# EasyEDA Pro project ProPrj_mykeyboard_2026-01-04.epro, board mykeyboard
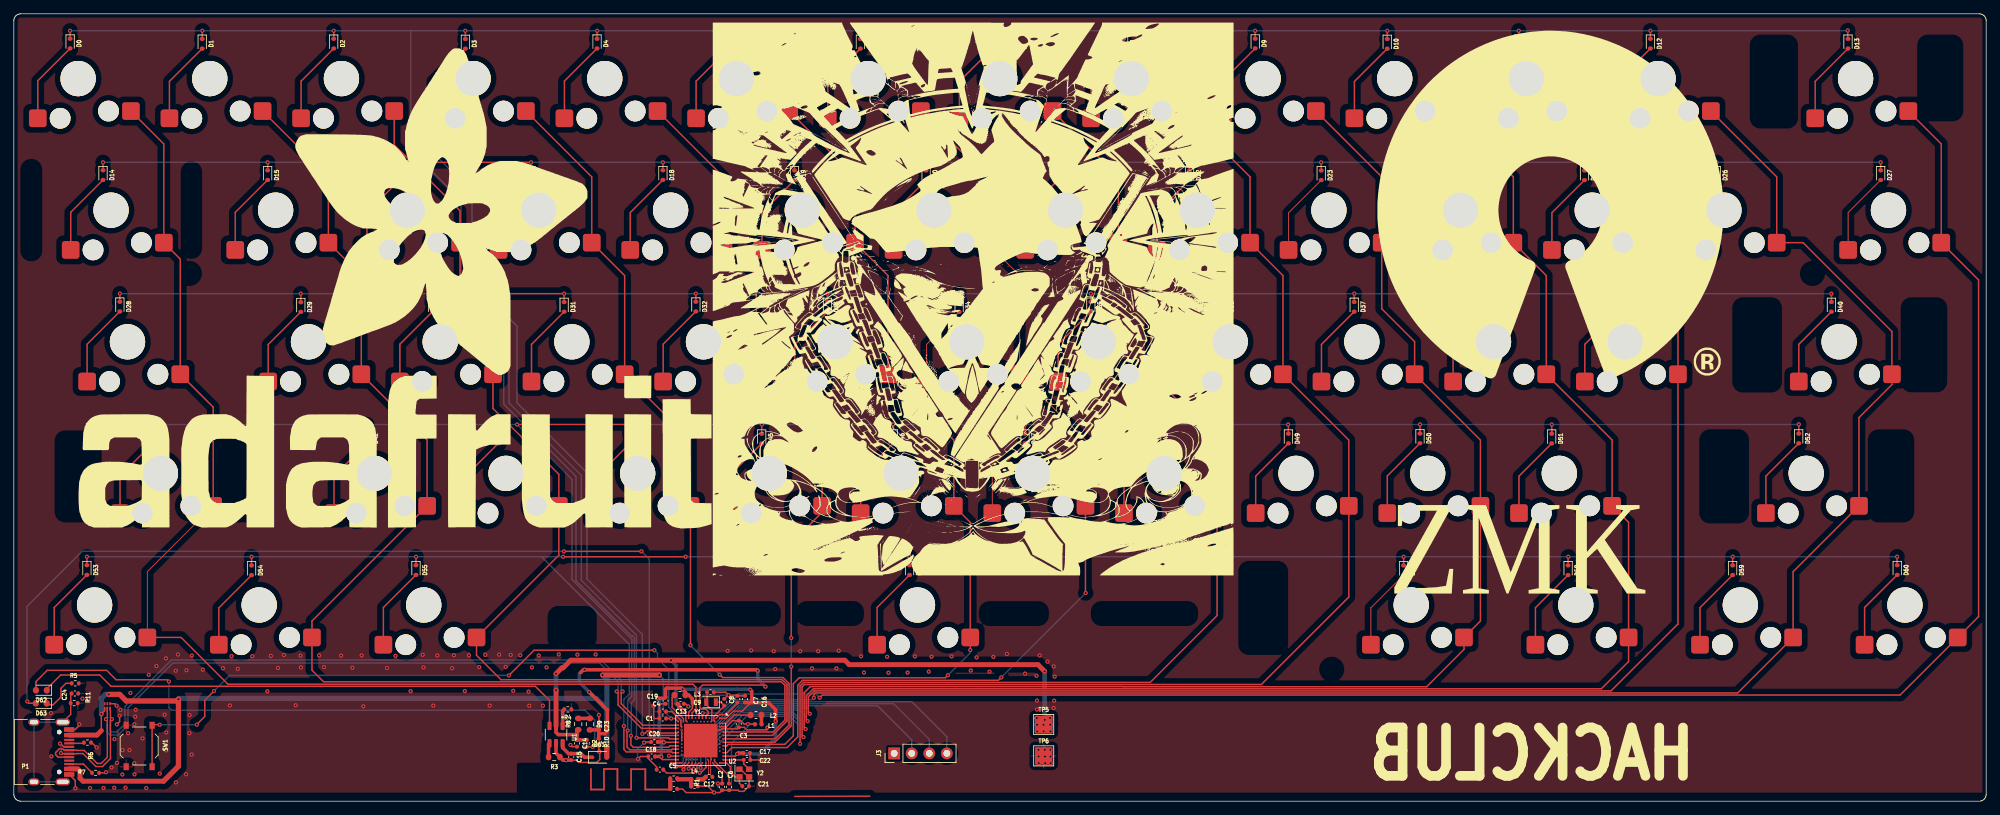
[diagram p1: board, top side]
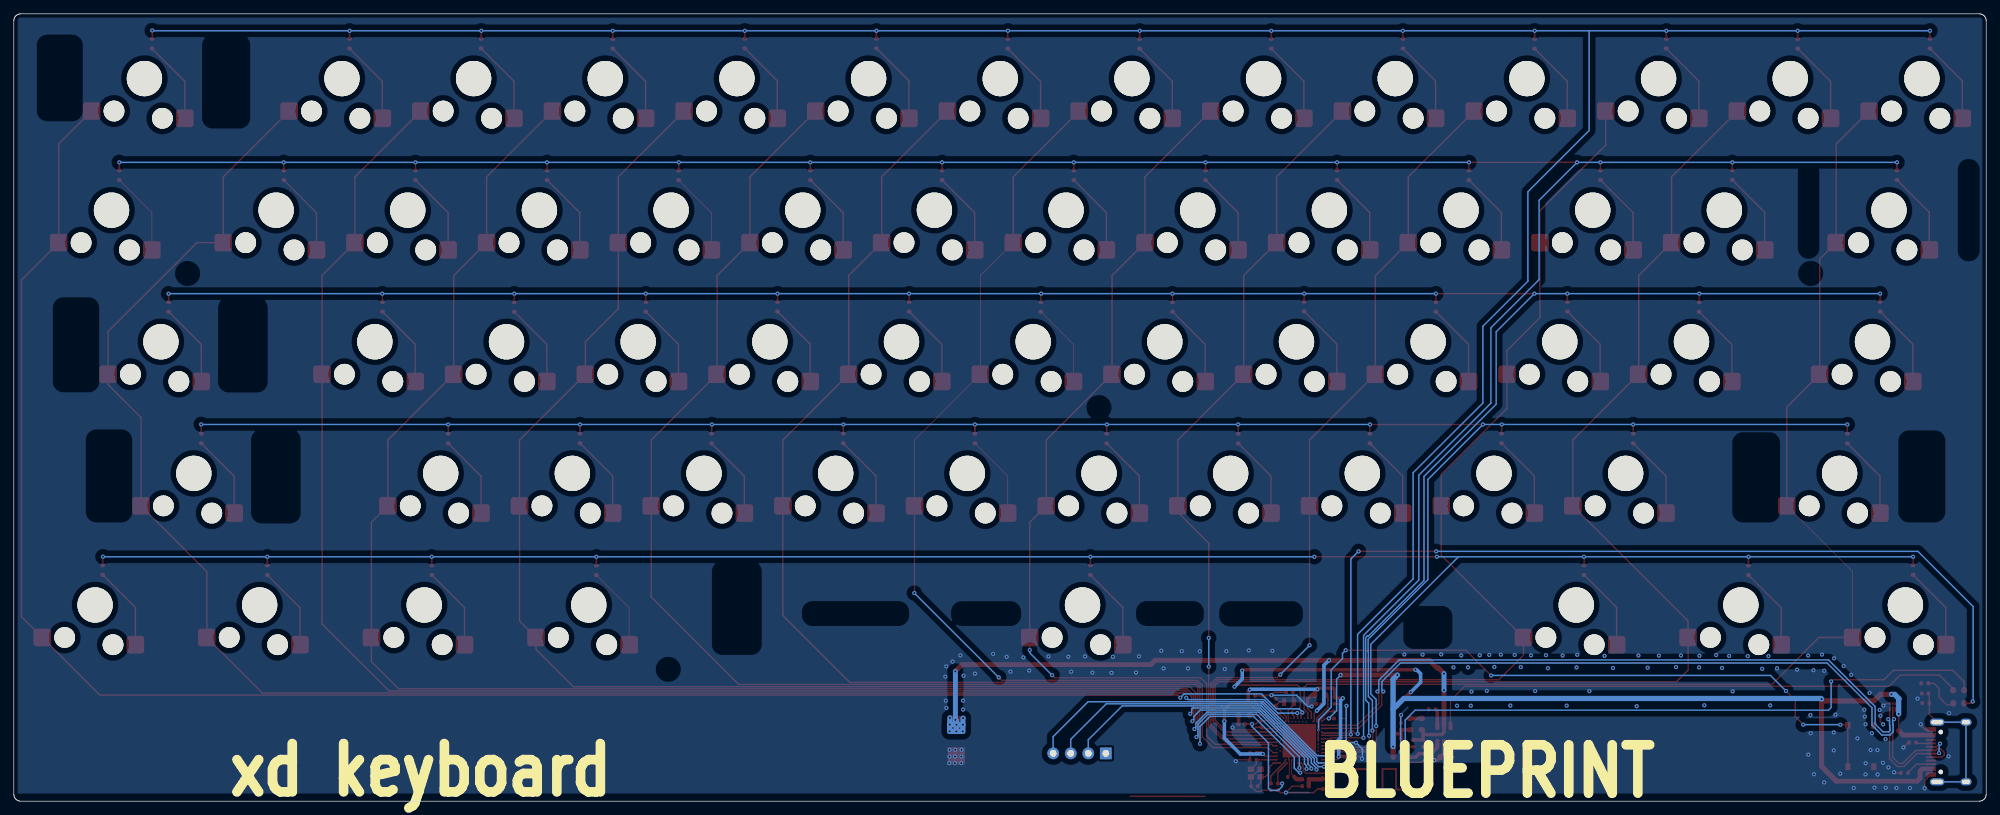
[diagram p2: board, bottom side, seen from below]

Outline 285.38 x 113.98 mm; copper layers: Top Layer, Bottom Layer. Coordinates in mm from the lower left corner of the outline.
Outline path: 284.38,0 1,0 0.92,0 0.84,0.01 0.77,0.03 0.69,0.05 0.62,0.08 0.55,0.11 0.48,0.15 0.41,0.19 0.35,0.24 0.29,0.29 0.24,0.35 0.19,0.41 0.15,0.48 0.11,0.55 0.08,0.62 0.05,0.69 0.03,0.77 0.01,0.84 0,0.92 0,1 0,112.98 0,113.05 0.01,113.13 0.03,113.21 0.05,113.28 0.08,113.36 0.11,113.43 0.15,113.5 0.19,113.56 0.24,113.63 0.29,113.68 0.35,113.74 0.41,113.79 0.48,113.83 0.55,113.87 0.62,113.9 0.69,113.93 0.77,113.95 0.84,113.96 0.92,113.97 1,113.98 284.38,113.98 284.45,113.97 284.53,113.96 284.61,113.95 284.69,113.93 284.76,113.9 284.83,113.87 284.9,113.83 284.96,113.79 285.02,113.74 285.08,113.68 285.14,113.63 285.19,113.56 285.23,113.5 285.27,113.43 285.3,113.36 285.33,113.28 285.35,113.21 285.36,113.13 285.37,113.05 285.38,112.98 285.38,1 285.37,0.92 285.36,0.84 285.35,0.77 285.33,0.69 285.3,0.62 285.27,0.55 285.23,0.48 285.19,0.41 285.14,0.35 285.08,0.29 285.02,0.24 284.96,0.19 284.9,0.15 284.83,0.11 284.76,0.08 284.69,0.05 284.61,0.03 284.53,0.01 284.45,0
Stack: Top Layer 0.035mm / Dielectric1 1.51mm FR4 er 4.5 / Bottom Layer 0.035mm

## Design rules (mm)
template: User Custom Config
spacing safeClearance (default): track to track 0.1, other pairs 0.1 to 0.3
track width trackWidth (default): min 0.127, default 0.254, max 2.54
differential pair differentialPair (default): width min 0.127, default 0.254, max 2.54; gap min 0.152, default 0.152
via viaSize (default): diameter min 0.3, default 0.6, max 10; hole min 0.2, default 0.3, max 6
net GND uses CopperRegion2
pour ie3188 uses CopperRegion2
pour ie3189 uses CopperRegion
pour ie3190 uses CopperRegion1

## Placement (name value [footprint] x y rotation side)
AE1  Antenna  [mikoto-footprints:2.4GHz-meander-antenna-v2]  88.37 3.16 0 top
C1  4.7uF  [Capacitor_SMD:C_0402_1005Metric]  93.89 11.97 0 top
C2  1uF  [Capacitor_SMD:C_0402_1005Metric]  102.48 2.07 90 top
C3  47nF  [Capacitor_SMD:C_0402_1005Metric]  104.89 11.17 90 top
C4  4.7uF  [Capacitor_SMD:C_0402_1005Metric]  93.89 12.97 180 top
C5  -  [Capacitor_SMD:C_0402_1005Metric]  93.48 4.57 180 top
C6  100pF  [Capacitor_SMD:C_0402_1005Metric]  103.48 2.07 270 top
C7  100nF  [Capacitor_SMD:C_0402_1005Metric]  104.69 14.77 90 top
C8  15pF  [Capacitor_SMD:C_0402_1005Metric]  102.78 14.32 270 top
C9  15pF  [Capacitor_SMD:C_0402_1005Metric]  100.78 15.77 180 top
C10  1.5pF  [Capacitor_SMD:C_0402_1005Metric]  95.48 1.77 180 top
C11  1pF  [Capacitor_SMD:C_0402_1005Metric]  98.48 2.17 180 top
C12  1pF  [Capacitor_SMD:C_0402_1005Metric]  100.59 3.52 180 top
C13  4.7uF  [Capacitor_SMD:C_0402_1005Metric]  96.45 14.09 180 top
C14  1uF  [Capacitor_SMD:C_0402_1005Metric]  81.48 8.37 270 top
C15  1uF  [Capacitor_SMD:C_0402_1005Metric]  80.66 6.41 270 top
C16  100nF  [Capacitor_SMD:C_0402_1005Metric]  105.78 14.77 270 top
C17  100nF  [Capacitor_SMD:C_0402_1005Metric]  106.03 6.97 180 top
C18  100nF  [Capacitor_SMD:C_0402_1005Metric]  92.28 6.47 0 top
C19  4.7uF  [Capacitor_SMD:C_0402_1005Metric]  94.28 14.57 90 top
C20  1uF  [Capacitor_SMD:C_0402_1005Metric]  92.69 8.57 0 top
C21  15pF  [Capacitor_SMD:C_0402_1005Metric]  105.89 2.17 0 top
C22  15pF  [Capacitor_SMD:C_0402_1005Metric]  106.09 5.97 0 top
C23  10nF  [Capacitor_SMD:C_0402_1005Metric]  84.64 10.84 270 top
C24  1000pF/NC  [Capacitor_SMD:C_0402_1005Metric]  8.84 15.59 0 top
D0  D  [Diode_SMD:D_SOD-523]  8.15 109.67 270 top
D1  D  [Diode_SMD:D_SOD-523]  27.25 109.64 270 top
D2  D  [Diode_SMD:D_SOD-523]  46.29 109.66 270 top
D3  D  [Diode_SMD:D_SOD-523]  65.34 109.63 270 top
D4  D  [Diode_SMD:D_SOD-523]  84.39 109.66 270 top
D5  D  [Diode_SMD:D_SOD-523]  103.45 109.65 270 top
D6  D  [Diode_SMD:D_SOD-523]  122.48 109.64 270 top
D7  D  [Diode_SMD:D_SOD-523]  141.56 109.64 270 top
D8  D  [Diode_SMD:D_SOD-523]  160.57 109.68 270 top
D9  D  [Diode_SMD:D_SOD-523]  179.62 109.68 270 top
D10  D  [Diode_SMD:D_SOD-523]  198.72 109.63 270 top
D11  D  [Diode_SMD:D_SOD-523]  217.77 109.67 270 top
D12  D  [Diode_SMD:D_SOD-523]  236.8 109.66 270 top
D13  D  [Diode_SMD:D_SOD-523]  265.38 109.65 270 top
D14  D  [Diode_SMD:D_SOD-523]  12.91 90.63 270 top
D15  D  [Diode_SMD:D_SOD-523]  36.73 90.63 270 top
D16  D  [Diode_SMD:D_SOD-523]  55.8 90.62 270 top
D17  D  [Diode_SMD:D_SOD-523]  74.84 90.61 270 top
D18  D  [Diode_SMD:D_SOD-523]  93.92 90.63 270 top
D19  D  [Diode_SMD:D_SOD-523]  112.95 90.61 270 top
D20  D  [Diode_SMD:D_SOD-523]  132 90.6 270 top
D21  D  [Diode_SMD:D_SOD-523]  151.07 90.61 270 top
D22  D  [Diode_SMD:D_SOD-523]  170.12 90.62 270 top
D23  D  [Diode_SMD:D_SOD-523]  189.16 90.6 270 top
D24  D  [Diode_SMD:D_SOD-523]  208.22 90.62 270 top
D25  D  [Diode_SMD:D_SOD-523]  227.25 90.61 270 top
D26  D  [Diode_SMD:D_SOD-523]  246.31 90.61 270 top
D27  D  [Diode_SMD:D_SOD-523]  270.12 90.62 270 top
D28  D  [Diode_SMD:D_SOD-523]  15.35 71.59 270 top
D29  D  [Diode_SMD:D_SOD-523]  41.53 71.53 270 top
D30  D  [Diode_SMD:D_SOD-523]  60.59 71.58 270 top
D31  D  [Diode_SMD:D_SOD-523]  79.62 71.55 270 top
D32  D  [Diode_SMD:D_SOD-523]  98.69 71.6 270 top
D33  D  [Diode_SMD:D_SOD-523]  117.73 71.55 270 top
D34  D  [Diode_SMD:D_SOD-523]  136.78 71.54 270 top
D35  D  [Diode_SMD:D_SOD-523]  155.84 71.58 270 top
D36  D  [Diode_SMD:D_SOD-523]  174.88 71.59 270 top
D37  D  [Diode_SMD:D_SOD-523]  193.94 71.56 270 top
D38  D  [Diode_SMD:D_SOD-523]  212.97 71.54 270 top
D39  D  [Diode_SMD:D_SOD-523]  232.03 71.57 270 top
D40  D  [Diode_SMD:D_SOD-523]  262.99 71.56 270 top
D41  D  [Diode_SMD:D_SOD-523]  20.08 52.5 270 top
D42  D  [Diode_SMD:D_SOD-523]  51.07 52.5 270 top
D43  D  [Diode_SMD:D_SOD-523]  70.12 52.52 270 top
D44  D  [Diode_SMD:D_SOD-523]  89.17 52.51 270 top
D45  D  [Diode_SMD:D_SOD-523]  108.2 52.49 270 top
D46  D  [Diode_SMD:D_SOD-523]  127.25 52.51 270 top
D47  D  [Diode_SMD:D_SOD-523]  146.31 52.5 270 top
D48  D  [Diode_SMD:D_SOD-523]  165.37 52.51 270 top
D49  D  [Diode_SMD:D_SOD-523]  184.41 52.49 270 top
D50  D  [Diode_SMD:D_SOD-523]  203.46 52.52 270 top
D51  D  [Diode_SMD:D_SOD-523]  222.52 52.49 270 top
D52  D  [Diode_SMD:D_SOD-523]  258.25 52.51 270 top
D53  D  [Diode_SMD:D_SOD-523]  10.58 33.46 270 top
D54  D  [Diode_SMD:D_SOD-523]  34.4 33.42 270 top
D55  D  [Diode_SMD:D_SOD-523]  58.19 33.45 270 top
D56  D  [Diode_SMD:D_SOD-523]  129.6 33.45 270 top
D57  D  [Diode_SMD:D_SOD-523]  201.09 33.43 270 top
D58  D  [Diode_SMD:D_SOD-523]  224.88 33.44 270 top
D59  D  [Diode_SMD:D_SOD-523]  248.69 33.44 270 top
D60  D  [Diode_SMD:D_SOD-523]  272.5 33.46 270 top
D61  B5819W SL  [Diode_SMD:D_SOD-323]  84.75 6.36 0 top
D62  CHG  [LED_SMD:LED_0603_1608Metric]  3.98 16.06 180 top
D63  BLUE  [LED_SMD:LED_0603_1608Metric]  3.97 14.17 180 top
J3  Debug  [Connector_PinHeader_2.54mm:PinHeader_1x04_P2.54mm_Vertical]  127.38 6.92 90 top
K0  -  [Gateron_KS33_Hotswap:Gateron-KS33-Hotswap-1U]  9.3 104.6 0 top
K1  !,1  [Gateron_KS33_Hotswap:Gateron-KS33-Hotswap-1U]  28.35 104.6 0 top
K2  @,2  [Gateron_KS33_Hotswap:Gateron-KS33-Hotswap-1U]  47.4 104.6 0 top
K3  #,3  [Gateron_KS33_Hotswap:Gateron-KS33-Hotswap-1U]  66.45 104.6 0 top
K4  $,4  [Gateron_KS33_Hotswap:Gateron-KS33-Hotswap-1U]  85.5 104.6 0 top
K5  %,5  [Gateron_KS33_Hotswap:Gateron-KS33-Hotswap-1U]  104.55 104.6 0 top
K6  ^,6  [Gateron_KS33_Hotswap:Gateron-KS33-Hotswap-1U]  123.6 104.6 0 top
K7  &,7  [Gateron_KS33_Hotswap:Gateron-KS33-Hotswap-1U]  142.65 104.6 0 top
K8  *,8  [Gateron_KS33_Hotswap:Gateron-KS33-Hotswap-1U]  161.7 104.6 0 top
K9  (,9  [Gateron_KS33_Hotswap:Gateron-KS33-Hotswap-1U]  180.75 104.6 0 top
K10  ),0  [Gateron_KS33_Hotswap:Gateron-KS33-Hotswap-1U]  199.8 104.6 0 top
K11  _,-  [Gateron_KS33_Hotswap:Gateron-KS33-Hotswap-1U]  218.85 104.6 0 top
K12  +,=  [Gateron_KS33_Hotswap:Gateron-KS33-Hotswap-1U]  237.9 104.6 0 top
K13  Backspace  [Gateron_KS33_Hotswap:Gateron-KS33-Hotswap-2U]  266.48 104.6 0 top
K14  -  [Gateron_KS33_Hotswap:Gateron-KS33-Hotswap-1.5U]  14.07 85.55 0 top
K15  Q  [Gateron_KS33_Hotswap:Gateron-KS33-Hotswap-1U]  37.88 85.55 0 top
K16  W  [Gateron_KS33_Hotswap:Gateron-KS33-Hotswap-1U]  56.93 85.55 0 top
K17  E  [Gateron_KS33_Hotswap:Gateron-KS33-Hotswap-1U]  75.98 85.55 0 top
K18  R  [Gateron_KS33_Hotswap:Gateron-KS33-Hotswap-1U]  95.03 85.55 0 top
K19  T  [Gateron_KS33_Hotswap:Gateron-KS33-Hotswap-1U]  114.08 85.55 0 top
K20  Y  [Gateron_KS33_Hotswap:Gateron-KS33-Hotswap-1U]  133.13 85.55 0 top
K21  U  [Gateron_KS33_Hotswap:Gateron-KS33-Hotswap-1U]  152.18 85.55 0 top
K22  I  [Gateron_KS33_Hotswap:Gateron-KS33-Hotswap-1U]  171.23 85.55 0 top
K23  O  [Gateron_KS33_Hotswap:Gateron-KS33-Hotswap-1U]  190.28 85.55 0 top
K24  P  [Gateron_KS33_Hotswap:Gateron-KS33-Hotswap-1U]  209.33 85.55 0 top
K25  {,[  [Gateron_KS33_Hotswap:Gateron-KS33-Hotswap-1U]  228.38 85.55 0 top
K26  },]  [Gateron_KS33_Hotswap:Gateron-KS33-Hotswap-1U]  247.43 85.55 0 top
K27  |,\\  [Gateron_KS33_Hotswap:Gateron-KS33-Hotswap-1.5U]  271.24 85.55 0 top
K28  Caps Lock  [Gateron_KS33_Hotswap:Gateron-KS33-Hotswap-1.75U]  16.45 66.5 0 top
K29  A  [Gateron_KS33_Hotswap:Gateron-KS33-Hotswap-1U]  42.64 66.5 0 top
K30  S  [Gateron_KS33_Hotswap:Gateron-KS33-Hotswap-1U]  61.69 66.5 0 top
K31  D  [Gateron_KS33_Hotswap:Gateron-KS33-Hotswap-1U]  80.74 66.5 0 top
K32  F  [Gateron_KS33_Hotswap:Gateron-KS33-Hotswap-1U]  99.79 66.5 0 top
K33  G  [Gateron_KS33_Hotswap:Gateron-KS33-Hotswap-1U]  118.84 66.5 0 top
K34  H  [Gateron_KS33_Hotswap:Gateron-KS33-Hotswap-1U]  137.89 66.5 0 top
K35  J  [Gateron_KS33_Hotswap:Gateron-KS33-Hotswap-1U]  156.94 66.5 0 top
K36  K  [Gateron_KS33_Hotswap:Gateron-KS33-Hotswap-1U]  175.99 66.5 0 top
K37  L  [Gateron_KS33_Hotswap:Gateron-KS33-Hotswap-1U]  195.04 66.5 0 top
K38  :,;  [Gateron_KS33_Hotswap:Gateron-KS33-Hotswap-1U]  214.09 66.5 0 top
K39  \",'  [Gateron_KS33_Hotswap:Gateron-KS33-Hotswap-1U]  233.14 66.5 0 top
K40  Enter  [Gateron_KS33_Hotswap:Gateron-KS33-Hotswap-2.25U]  264.1 66.5 0 top
K41  -  [Gateron_KS33_Hotswap:Gateron-KS33-Hotswap-2.25U]  21.21 47.45 0 top
K42  Z  [Gateron_KS33_Hotswap:Gateron-KS33-Hotswap-1U]  52.16 47.45 0 top
K43  X  [Gateron_KS33_Hotswap:Gateron-KS33-Hotswap-1U]  71.22 47.45 0 top
K44  C  [Gateron_KS33_Hotswap:Gateron-KS33-Hotswap-1U]  90.27 47.45 0 top
K45  V  [Gateron_KS33_Hotswap:Gateron-KS33-Hotswap-1U]  109.31 47.45 0 top
K46  B  [Gateron_KS33_Hotswap:Gateron-KS33-Hotswap-1U]  128.37 47.45 0 top
K47  N  [Gateron_KS33_Hotswap:Gateron-KS33-Hotswap-1U]  147.41 47.45 0 top
K48  M  [Gateron_KS33_Hotswap:Gateron-KS33-Hotswap-1U]  166.47 47.45 0 top
K49  <,,  [Gateron_KS33_Hotswap:Gateron-KS33-Hotswap-1U]  185.52 47.45 0 top
K50  >,.  [Gateron_KS33_Hotswap:Gateron-KS33-Hotswap-1U]  204.56 47.45 0 top
K51  ?,/  [Gateron_KS33_Hotswap:Gateron-KS33-Hotswap-1U]  223.62 47.45 0 top
K52  Shift  [Gateron_KS33_Hotswap:Gateron-KS33-Hotswap-2.75U]  259.33 47.45 0 top
K53  Ctrl  [Gateron_KS33_Hotswap:Gateron-KS33-Hotswap-1.25U]  11.68 28.4 0 top
K54  Win  [Gateron_KS33_Hotswap:Gateron-KS33-Hotswap-1.25U]  35.5 28.4 0 top
K55  Alt  [Gateron_KS33_Hotswap:Gateron-KS33-Hotswap-1.25U]  59.31 28.4 0 top
K56  Blank  [Gateron_KS33_Hotswap:Gateron-KS33-Hotswap-6.25U]  130.75 28.4 0 top
K57  Alt  [Gateron_KS33_Hotswap:Gateron-KS33-Hotswap-1.25U]  202.18 28.4 0 top
K58  Win  [Gateron_KS33_Hotswap:Gateron-KS33-Hotswap-1.25U]  226 28.4 0 top
K59  Menu  [Gateron_KS33_Hotswap:Gateron-KS33-Hotswap-1.25U]  249.81 28.4 0 top
K60  Ctrl  [Gateron_KS33_Hotswap:Gateron-KS33-Hotswap-1.25U]  273.62 28.4 0 top
L1  15nH  [Inductor_SMD:L_0402_1005Metric]  107.71 11.13 0 top
L2  10uH  [Inductor_SMD:L_0603_1608Metric]  107.39 12.47 180 top
L3  10uH  [Inductor_SMD:L_0603_1608Metric]  96.39 15.37 180 top
L4  3.9nH  [Inductor_SMD:L_0402_1005Metric]  98.48 3.17 0 top
NOREF  -  [Pad_e4740]  25.39 76.39 0 top
NOREF#2  -  [Pad_e4739]  128.37 56.98 0 top
NOREF#3  -  [Pad_e4736]  260.23 76.39 0 top
NOREF#4  -  [Pad_e4738]  190.68 19.09 0 top
NT1  NetTie_2  [mikoto-footprints:net-tie-2-tiny]  100.89 6.27 90 top
P1  USB-C  [Connector_USB:USB_C_Receptacle_HRO_TYPE-C-31-M-12]  3.97 7.12 270 top
R1  0R  [Resistor_SMD:R_0402_1005Metric]  95.48 3.27 180 top
R2  10k  [Resistor_SMD:R_0402_1005Metric]  82.88 8.37 270 top
R3  2.7k  [Resistor_SMD:R_0603_1608Metric]  78.2 6.39 180 top
R4  10k  [Resistor_SMD:R_0402_1005Metric]  80.17 13.29 180 top
R5  1.5k  [Resistor_SMD:R_0402_1005Metric]  8.89 17.06 180 top
R6  5.1k  [Resistor_SMD:R_0402_1005Metric]  10.66 8.48 0 top
R7  5.1k  [Resistor_SMD:R_0402_1005Metric]  11.83 4.09 0 top
R8  2M  [Resistor_SMD:R_0603_1608Metric]  81.67 11.16 90 top
R9  -  [Resistor_SMD:R_0603_1608Metric]  83.36 11.15 270 top
R10  -  [Resistor_SMD:R_0402_1005Metric]  84.62 8.55 270 top
R11  1M  [Resistor_SMD:R_0402_1005Metric]  8.74 14.19 180 top
SW1  Reset  [Button_Switch_SMD:SW_Push_1P1T_XKB_TS-1187A]  18.13 7.99 270 top
TP5  VBAT  [TestPoint:TestPoint_Pad_2.5x2.5mm]  149.01 11.11 0 top
TP6  BAT GND  [TestPoint:TestPoint_Pad_2.5x2.5mm]  149.01 6.56 0 top
U1  BQ21040DBVR  [BQ21040:SOT95P280X145-6N]  78.45 9.64 270 top
U2  nRF52840  [Package_DFN_QFN:Nordic_AQFN-73-1EP_7x7mm_P0.5mm]  99.39 8.77 270 top
U3  ESDR0502NMUTAG  [mikoto-footprints:UDFN-6_1.2x1.0mm_P0.4mm]  13.54 13.79 270 top
Y1  32.768 kHz  [Crystal:Crystal_SMD_2012-2Pin_2.0x1.2mm]  100.89 14.32 180 top
Y2  32MHz  [Crystal:Crystal_SMD_2016-4Pin_2.0x1.6mm]  105.69 4.07 0 top

## Footprints (pads in the part's own frame, mm; a bottom-side part is the same pattern mirrored in y, then rotated)
BQ21040:SOT95P280X145-6N
  rrect 1.21x0.58 smd: 1(-1.255,0.95) 2(-1.255,0) 3(-1.255,-0.95) 4(1.255,-0.95) 5(1.255,0) 6(1.255,0.95)
Button_Switch_SMD:SW_Push_1P1T_XKB_TS-1187A
  rect 1x0.75 smd: 1(-3,1.875) 1(3,1.875) 2(-3,-1.875) 2(3,-1.875)
Capacitor_SMD:C_0402_1005Metric
  rrect 0.56x0.62 smd: 1(-0.48,0) 2(0.48,0)
Connector_PinHeader_2.54mm:PinHeader_1x04_P2.54mm_Vertical
  rect 1.7x1.7 hole 1: 1(0,0)
  round 1.7 hole 1: 2(0,-2.54) 3(0,-5.08) 4(0,-7.62)
Connector_USB:USB_C_Receptacle_HRO_TYPE-C-31-M-12
  round 0.65 hole 0.65: (-2.89,2.6) (2.89,2.6)
  rect 0.6x1.45 smd: A1(-3.25,4.045) A4(-2.45,4.045) A9(2.45,4.045) A12(3.25,4.045) B1(3.25,4.045) B4(2.45,4.045) B9(-2.45,4.045) B12(-3.25,4.045)
  rect 0.3x1.45 smd: A5(-1.25,4.045) A6(-0.25,4.045) A7(0.25,4.045) A8(1.25,4.045) B5(1.75,4.045) B6(0.75,4.045) B7(-0.75,4.045) B8(-1.75,4.045)
  oval 1x2.1 hole 0.6x1.7: S1(-4.32,3.13) S1(4.32,3.13)
  oval 1x1.6 hole 0.6x1.2: S1(-4.32,-1.05) S1(4.32,-1.05)
Crystal:Crystal_SMD_2012-2Pin_2.0x1.2mm
  rect 0.6x1.1 smd: 1(-0.7,0) 2(0.7,0)
Crystal:Crystal_SMD_2016-4Pin_2.0x1.6mm
  rect 0.9x0.8 smd: 1(-0.7,-0.55) 2(0.7,-0.55) 3(0.7,0.55) 4(-0.7,0.55)
Diode_SMD:D_SOD-323
  rrect 0.6x0.45 smd: 1(-1.05,0) 2(1.05,0)
Diode_SMD:D_SOD-523
  rrect 0.6x0.7 smd: 1(-0.7,0) 2(0.7,0)
Gateron_KS33_Hotswap:Gateron-KS33-Hotswap-1.5U
  round 3 hole 3: (-2.6,-5.75) (4.4,-4.7)
  round 5.1 hole 5.1: (0,0)
  rrect 2.55x2.55 smd: 1(7.638,-4.7) 2(-5.838,-5.75)
Gateron_KS33_Hotswap:Gateron-KS33-Hotswap-1.25U
  round 3 hole 3: (-2.6,-5.75) (4.4,-4.7)
  round 5.1 hole 5.1: (0,0)
  rrect 2.55x2.55 smd: 1(7.638,-4.7) 2(-5.838,-5.75)
Gateron_KS33_Hotswap:Gateron-KS33-Hotswap-1.75U
  round 3 hole 3: (-2.6,-5.75) (4.4,-4.7)
  round 5.1 hole 5.1: (0,0)
  rrect 2.55x2.55 smd: 1(7.638,-4.7) 2(-5.838,-5.75)
Gateron_KS33_Hotswap:Gateron-KS33-Hotswap-1U
  round 3 hole 3: (-2.6,-5.75) (4.4,-4.7)
  round 5.1 hole 5.1: (0,0)
  rrect 2.55x2.55 smd: 1(7.638,-4.7) 2(-5.838,-5.75)
Gateron_KS33_Hotswap:Gateron-KS33-Hotswap-2.25U
  round 3 hole 3: (-2.6,-5.75) (4.4,-4.7)
  round 5.1 hole 5.1: (0,0)
  rrect 2.55x2.55 smd: 1(7.638,-4.7) 2(-5.838,-5.75)
Gateron_KS33_Hotswap:Gateron-KS33-Hotswap-2.75U
  round 3 hole 3: (-2.6,-5.75) (4.4,-4.7)
  round 5.1 hole 5.1: (0,0)
  rrect 2.55x2.55 smd: 1(7.638,-4.7) 2(-5.838,-5.75)
Gateron_KS33_Hotswap:Gateron-KS33-Hotswap-2U
  round 3 hole 3: (-2.6,-5.75) (4.4,-4.7)
  round 5.1 hole 5.1: (0,0)
  rrect 2.55x2.55 smd: 1(7.638,-4.7) 2(-5.838,-5.75)
Gateron_KS33_Hotswap:Gateron-KS33-Hotswap-6.25U
  round 3 hole 3: (-2.6,-5.75) (4.4,-4.7)
  round 5.1 hole 5.1: (0,0)
  rrect 2.55x2.55 smd: 1(7.638,-4.7) 2(-5.838,-5.75)
Inductor_SMD:L_0402_1005Metric
  rrect 0.59x0.64 smd: 1(-0.485,0) 2(0.485,0)
Inductor_SMD:L_0603_1608Metric
  rrect 0.875x0.95 smd: 1(-0.787,0) 2(0.787,0)
LED_SMD:LED_0603_1608Metric
  rrect 0.875x0.95 smd: 1(-0.787,0) 2(0.787,0)
mikoto-footprints:2.4GHz-meander-antenna-v2
  round 0.2 smd: 1(6.5,-1.5)
mikoto-footprints:net-tie-2-tiny
  round 0.15 smd: 1(-0.15,0) 2(0.15,0)
mikoto-footprints:UDFN-6_1.2x1.0mm_P0.4mm
  rect 0.42x0.22 smd: 1(-0.325,0.4) 2(-0.325,0) 3(-0.325,-0.4) 4(0.325,-0.4) 5(0.325,0) 6(0.325,0.4)
Package_DFN_QFN:Nordic_AQFN-73-1EP_7x7mm_P0.5mm
  rect 2x2 smd: (-1.212,1.212) (-1.212,-1.212) (1.212,1.212) (1.212,-1.212)
  round 0.25 smd: A8(-1.25,3.25) A10(-0.75,3.25) A12(-0.25,3.25) A14(0.25,3.25) A16(0.75,3.25) A18(1.25,3.25) A20(1.75,3.25) A22(2.25,3.25) A23(2.75,3.25) AA24(3.25,-2.25) AB2(-2.75,-2.5) AC5(-2,-2.75) AC9(-1,-2.75) AC11(-0.5,-2.75) AC13(0,-2.75) AC15(0.5,-2.75) AC17(1,-2.75) AC19(1.5,-2.75) AC21(2,-2.75) AC24(3.25,-2.75) AD2(-2.75,-3.25) AD4(-2.25,-3.25) AD6(-1.75,-3.25) AD8(-1.25,-3.25) AD10(-0.75,-3.25) AD12(-0.25,-3.25) AD14(0.25,-3.25) AD16(0.75,-3.25) AD18(1.25,-3.25) AD20(1.75,-3.25) AD22(2.25,-3.25) AD23(2.75,-3.25) B1(-3.25,2.75) B3(-2.5,2.75) B5(-2,2.75) B7(-1.5,2.75) B9(-1,2.75) B11(-0.5,2.75) B13(0,2.75) B15(0.5,2.75) B17(1,2.75) B19(1.5,2.75) B24(3.25,2.75) C1(-3.25,2.25) D2(-2.75,2) D23(2.75,2) E24(3.25,1.75) F2(-2.75,1.5) F23(2.75,1.5) G1(-3.25,1.25) H2(-2.75,1) H23(2.75,1) J1(-3.25,0.75) J24(3.25,0.75) K2(-2.75,0.5) L1(-3.25,0.25) L24(3.25,0.25) M2(-2.75,0) N1(-3.25,-0.25) N24(3.25,-0.25) P2(-2.75,-0.5) P23(2.75,-0.5) R1(-3.25,-0.75) R24(3.25,-0.75) T2(-2.75,-1) T23(2.75,-1) U1(-3.25,-1.25) U24(3.25,-1.25) V23(2.75,-1.5) W1(-3.25,-1.75) W24(3.25,-1.75) Y2(-2.75,-2) Y23(2.75,-2)
  rect 4.85x4.85 smd: EP(0,0)
Pad_e4736
  round 0.003 hole 2: 1(0,0)
Pad_e4738
  round 0.003 hole 2: 1(0,0)
Pad_e4739
  round 0.003 hole 2: 1(0,0)
Pad_e4740
  round 0.003 hole 2: 1(0,0)
Resistor_SMD:R_0402_1005Metric
  rrect 0.54x0.64 smd: 1(-0.51,0) 2(0.51,0)
Resistor_SMD:R_0603_1608Metric
  rrect 0.8x0.95 smd: 1(-0.825,0) 2(0.825,0)
TestPoint:TestPoint_Pad_2.5x2.5mm
  rect 2.5x2.5 smd: 1(0,0)

## Nets
GND: C1.1 C2.1 C3.1 C4.2 C5.2 C6.2 C7.2 C8.1 C9.1 C10.1 C11.1 C13.1 C14.2 C15.2 C16.1 C17.1 C18.1 C19.1 C20.1 C21.2 C22.2 C23.1 C24.2 J3.1 NT1.2 P1.A1 P1.A12 P1.B1 P1.B12 R3.1 R4.1 R5.1 R6.2 R7.2 R10.2 R11.1 SW1.2 TP6.1 U1.5 U2.B7 U2.EP U3.1 Y2.2 Y2.4
VBAT: C13.2 C14.1 R2.1 R8.1 TP5.1 U1.2 U2.Y2
VBUS: C1.2 D61.2 P1.A4 P1.A9 P1.B4 P1.B9 U2.AD2 U3.4
VDD_NRF: C16.2 C17.2 C18.2 C19.2 C20.2 L3.1 U2.A22 U2.AD14 U2.AD23 U2.B1 U2.W1
VSS_PA: C12.1 NT1.1 U2.F23
/ANT: AE1.1 C10.2 R1.2
/CC1: P1.A5 R6.1
/CC2: P1.B5 R7.1
/COL_0: K0.1 K14.1 K28.1 K41.1 K53.1 U2.U1
/COL_1: K1.1 K15.1 K29.1 K42.1 K54.1 U2.A8
/COL_2: K2.1 K16.1 K30.1 K43.1 K55.1 U2.A10
/COL_3: K3.1 K17.1 K31.1 K44.1 U2.A12
/COL_4: K4.1 K18.1 K32.1 K45.1 U2.A14
/COL_5: K5.1 K19.1 K33.1 K46.1 K56.1 U2.A16
/COL_6: K6.1 K20.1 K34.1 K47.1 U2.A20
/COL_7: K7.1 K21.1 K35.1 K48.1 U2.J24
/COL_8: K8.1 K22.1 K36.1 K49.1 U2.L24
/COL_9: K9.1 K23.1 K37.1 K50.1 K57.1 U2.R24
/COL_10: K10.1 K24.1 K38.1 K51.1 K58.1 U2.U24
/COL_11: K11.1 K25.1 K39.1 U2.W24
/COL_12: K12.1 K26.1 K40.1 K52.1 K59.1 U2.L1
/COL_13: K13.1 K27.1 K60.1 U2.N1
/ROW_0: D0.1 D1.1 D2.1 D3.1 D4.1 D5.1 D6.1 D7.1 D8.1 D9.1 D10.1 D11.1 D12.1 D13.1 U2.AD8
/ROW_1: D14.1 D15.1 D16.1 D17.1 D18.1 D19.1 D20.1 D21.1 D22.1 D23.1 D24.1 D25.1 D26.1 D27.1 U2.AD12
/ROW_2: D28.1 D29.1 D30.1 D31.1 D32.1 D33.1 D34.1 D35.1 D36.1 D37.1 D38.1 D39.1 D40.1 U2.AD16
/ROW_3: D41.1 D42.1 D43.1 D44.1 D45.1 D46.1 D47.1 D48.1 D49.1 D50.1 D51.1 D52.1 U2.AD18
/ROW_4: D53.1 D54.1 D55.1 D56.1 D57.1 D58.1 D59.1 D60.1 U2.AD20
BAT_VOLT: C23.2 R9.2 R10.1 U2.J1
BLUE_LED: D63.2 U2.AD10
NET-(C11-PAD2): C11.2 L4.1 R1.1
NET-(D0-A): D0.2 K0.2
NET-(D1-A): D1.2 K1.2
NET-(D2-A): D2.2 K2.2
NET-(D3-A): D3.2 K3.2
NET-(D4-A): D4.2 K4.2
NET-(D5-A): D5.2 K5.2
NET-(D6-A): D6.2 K6.2
NET-(D7-A): D7.2 K7.2
NET-(D8-A): D8.2 K8.2
NET-(D9-A): D9.2 K9.2
NET-(D10-A): D10.2 K10.2
NET-(D11-A): D11.2 K11.2
NET-(D12-A): D12.2 K12.2
NET-(D13-A): D13.2 K13.2
NET-(D14-A): D14.2 K14.2
NET-(D15-A): D15.2 K15.2
NET-(D16-A): D16.2 K16.2
NET-(D17-A): D17.2 K17.2
NET-(D18-A): D18.2 K18.2
NET-(D19-A): D19.2 K19.2
NET-(D20-A): D20.2 K20.2
NET-(D21-A): D21.2 K21.2
NET-(D22-A): D22.2 K22.2
NET-(D23-A): D23.2 K23.2
NET-(D24-A): D24.2 K24.2
NET-(D25-A): D25.2 K25.2
NET-(D26-A): D26.2 K26.2
NET-(D27-A): D27.2 K27.2
NET-(D28-A): D28.2 K28.2
NET-(D29-A): D29.2 K29.2
NET-(D30-A): D30.2 K30.2
NET-(D31-A): D31.2 K31.2
NET-(D32-A): D32.2 K32.2
NET-(D33-A): D33.2 K33.2
NET-(D34-A): D34.2 K34.2
NET-(D35-A): D35.2 K35.2
NET-(D36-A): D36.2 K36.2
NET-(D37-A): D37.2 K37.2
NET-(D38-A): D38.2 K38.2
NET-(D39-A): D39.2 K39.2
NET-(D40-A): D40.2 K40.2
NET-(D41-A): D41.2 K41.2
NET-(D42-A): D42.2 K42.2
NET-(D43-A): D43.2 K43.2
NET-(D44-A): D44.2 K44.2
NET-(D45-A): D45.2 K45.2
NET-(D46-A): D46.2 K46.2
NET-(D47-A): D47.2 K47.2
NET-(D48-A): D48.2 K48.2
NET-(D49-A): D49.2 K49.2
NET-(D50-A): D50.2 K50.2
NET-(D51-A): D51.2 K51.2
NET-(D52-A): D52.2 K52.2
NET-(D53-A): D53.2 K53.2
NET-(D54-A): D54.2 K54.2
NET-(D55-A): D55.2 K55.2
NET-(D56-A): D56.2 K56.2
NET-(D57-A): D57.2 K57.2
NET-(D58-A): D58.2 K58.2
NET-(D59-A): D59.2 K59.2
NET-(D60-A): D60.2 K60.2
NET-(D61-K): C15.1 D61.1 U1.6
NET-(D62-A): D62.2 R2.2
NET-(D62-K): D62.1 U1.3
NET-(D63-K): D63.1 R5.2
NET-(L1-PAD2): L1.2 L2.1
NET-(P1-SHIELD): C24.1 P1.S1 R11.2
NET-(R8-PAD2): R8.2 R9.1
NET-(U1-ISET): R3.2 U1.4
NET-(U1-TS): R4.2 U1.1
NET-(U2-ANT): C12.2 L4.2 U2.H23
NET-(U2-DCC): L2.2 U2.B3
NET-(U2-DCCH): L3.2 U2.AB2
NET-(U2-DEC1): C7.1 U2.C1
NET-(U2-DEC3): C6.1 U2.D23
NET-(U2-DEC4): C2.2 C3.2 L1.1 U2.B5 U2.E24
NET-(U2-DEC5): C5.1 U2.N24
NET-(U2-DECUSB): C4.1 U2.AC5
NET-(U2-XC1): C21.1 U2.B24 Y2.1
NET-(U2-XC2): C22.1 U2.A23 Y2.3
NET-(U2-XL1{SLASH}P0.00): C8.2 U2.D2 Y1.1
NET-(U2-XL2{SLASH}P0.01): C9.2 U2.F2 Y1.2
RESET: SW1.1 U2.AC9 U2.AC11 U2.AC13
SWC: J3.2 U2.AA24
SWD: J3.3 U2.AC24
SWO: J3.4 U2.AD22
UNCONNECTED-(U2-AIN1{SLASH}P0.03-PADB13): U2.B13
UNCONNECTED-(U2-AIN3{SLASH}P0.05-PADK2): U2.K2
UNCONNECTED-(U2-AIN4{SLASH}P0.28-PADB11): U2.B11
UNCONNECTED-(U2-AIN6{SLASH}P0.30-PADB9): U2.B9
UNCONNECTED-(U2-DEC2-PADA18): U2.A18
UNCONNECTED-(U2-P0.19-PADAC15): U2.AC15
UNCONNECTED-(U2-P0.21-PADAC17): U2.AC17
UNCONNECTED-(U2-P0.23-PADAC19): U2.AC19
UNCONNECTED-(U2-P0.26-PADG1): U2.G1
UNCONNECTED-(U2-P0.27-PADH2): U2.H2
UNCONNECTED-(U2-P1.01-PADY23): U2.Y23
UNCONNECTED-(U2-P1.03-PADV23): U2.V23
UNCONNECTED-(U2-P1.05-PADT23): U2.T23
UNCONNECTED-(U2-P1.07-PADP23): U2.P23
UNCONNECTED-(U2-P1.08-PADP2): U2.P2
UNCONNECTED-(U2-P1.11-PADB19): U2.B19
UNCONNECTED-(U2-P1.12-PADB17): U2.B17
UNCONNECTED-(U2-P1.14-PADB15): U2.B15
UNCONNECTED-(U2-TRACECLK{SLASH}P0.07-PADM2): U2.M2
UNCONNECTED-(U2-TRACEDATA2{SLASH}P0.11-PADT2): U2.T2
UNCONNECTED-(U2-TRACEDATA3{SLASH}P1.09-PADR1): U2.R1
UNCONNECTED-(U3-NC-PAD2): U3.2
UNCONNECTED-(U3-NC-PAD3): U3.3
USB_D+: P1.A6 P1.B6 U2.AD6 U3.5
USB_D-: P1.A7 P1.B7 U2.AD4 U3.6

Pads without a net: NOREF 1; NOREF#2 1; NOREF#3 1; NOREF#4 1; P1 A8 B8; U2 AC21

## Via types
v1: diameter 0.6, hole 0.3, Top Layer to Bottom Layer, 292 vias
v2: diameter 0.61, hole 0.305, Top Layer to Bottom Layer, 2 vias
v3: diameter 0.3, hole 0.2, Top Layer to Bottom Layer, 1 via

## Routing (per net, layer and track width the routed paths; a pad name or vN(x,y) marks a point on that pad's centre or on a via; arc(x,y) is an arc through that point)
GND: length 91.8
  Top Layer w0.2: v2(11.97,7.78) 11.28,8.48 R6.2 ; 13.94,14.12 14.58,14.12 v1(14.87,13.83) ; C11.1 100.41,2.17 v1(101.33,1.25) ; v1(13.34,4.19) 13.24,4.09 R7.2 ; 96.94,14.09 97.22,14.09 v1(97.59,13.72) ; v1(15.31,12.37) 15.31,11.51 v1(14.92,11.12) ; U2.EP 99.39,10.19 99.47,10.27 U2.B7 102.22,10.27 102.42,10.47 104.67,10.47 C3.1 105.69,10.69 106.05,10.33 108.97,10.33 109.05,10.41 v1(109.05,10.66) ; R10.2 84.62,7.53 84.78,7.38 84.78,6.03 84.36,5.61 81.72,5.61 81.37,5.96 81.34,5.93 C15.2 ; C19.1 93.66,14.09 93.41,13.84 C4.2 C1.1 92.64,11.97 92.56,12.05 v1(92.56,13.81) ; v1(9.46,11.12) 9.46,10.97 8.87,10.37 P1.A1 ; C14.2 80.78,7.89 v1(80.53,8.14) ; v2(103.42,15.34) 104.59,15.34 C7.2 C16.1 ; v2(103.42,15.34) 102.98,15.77 C9.1 ; v2(103.42,15.34) 103.33,15.34 C8.1 ; v1(84.66,12.47) 84.64,12.46 C23.1 ; Y2.4 105.16,4.62 106.26,3.52 Y2.2 106.39,2.19 C21.2 105.62,1.42 104.97,1.42 104.8,1.59 C6.2 C2.1 102.14,1.25 v1(101.33,1.25) ; C5.2 93,4.96 91.81,6.16 C18.1 90.66,6.47 v1(90.31,6.13) ; P1.A12 8.9,2.99 v1(8.9,1.87) ; v1(101.33,1.25) 97.28,1.25 96.75,1.77 C10.1 ; v1(91.19,8.47) 91.28,8.57 C20.1 ; v1(108.58,5.78) 108.39,5.97 C22.2 106.52,6.02 C17.1
  Top Layer w0.5: 78.45,8.39 78.45,6.96 R3.1 79.48,5.93 v1(79.89,5.93) C15.2
  Bottom Layer w0.2: v1(92.56,13.81) 92.62,13.74 ; v1(84.72,7.15) 84.72,12.4 v1(84.66,12.47) ; 92.61,13.76 92.61,8.8 92.25,8.45 92.23,8.45 92.22,8.47 v1(91.19,8.47) 90.28,7.56 90.25,7.56 90.25,6.2 v1(90.31,6.13) ; v1(97.59,13.72) 98.16,13.72 99.78,15.34 v2(103.42,15.34)
  vias: v1(5.38,12.75) v1(5.45,6.49) v1(9.94,14.84) v1(11.04,1.9) v1(12.99,1.91) v1(14.13,4.89) v1(14.54,1.94) v1(14.56,8.98) v1(14.93,5.54) v1(15.42,13.21) v1(15.71,3.86) v1(15.74,7.39) v1(16.15,1.96) v1(16.54,9.84) v1(16.73,7.39) v1(16.88,15.67) v1(17.43,5.49) v1(17.45,11.13) v1(17.45,3.88) v1(17.63,13.24) v1(17.56,12.24) v1(18.63,9.09) v1(19.16,1.9) v1(19.52,18.29) v1(20.62,19.56) v1(21.11,3.99) v1(21.8,12.53) v1(22,20.68) v1(22.05,9.95) v1(22.05,7.35) v1(23.43,18.88) v1(23.45,2.72) v1(23.74,21.22) v1(24.92,3.9) v1(24.99,18.95) v1(25.43,12.46) v1(25.39,9.84) v1(25.75,21.08) v1(25.73,6.74) v1(27.34,19.04) v1(30.25,19.24) v1(31.25,13.86) v1(31.5,21) v1(32.41,19.16) v1(34.51,21) v1(36.68,15.9) v1(37.19,21.03) v1(38.22,19.29) v1(39.08,21.15) v1(40.79,13.88) v1(41.48,21.05) v1(41.54,19.36) v1(44.16,21.09) v1(44.88,19.41) v1(47.36,21.07) v1(48.98,19.32) v1(50.32,21.09) v1(50.57,13.74) v1(54,19.28) v1(55.23,21.04) v1(57.41,15.92) v1(59.16,21.19) v1(59.28,19.36) v1(60.7,13.83) v1(61.29,21.09) v1(63.42,19.25) v1(63.69,21.14) v1(65.25,15.94) v1(65.86,21.11) v1(67.34,19.41) v1(68.22,21.17) v1(68.84,13.84) v1(70.23,21.21) v1(71.17,19.43) v1(71.89,21.17) v1(72.25,15.97) v1(73.28,21.12) v1(74.48,15.85) v1(74.58,13.82) v1(75.95,21.09) v1(76.56,13.82) v1(78.84,21.25) v1(81.55,21.21) v1(84.19,21.24) v1(103.28,21.76) v1(106.69,21.83) v1(109.95,21.71) v1(110.17,19.12) v1(113.78,21.7) v1(115.5,19.22) v1(116.39,21.71) v1(119.03,19.22) v1(119.34,21.78) v1(122.58,20.97) v1(123,18.62) v1(126.36,20.9) v1(126.56,18.59) v1(129.31,18.61) v1(130.38,20.96) v1(132.38,18.75) v1(132.78,20.91) v1(135.69,20.96) v1(138.46,18.91) v1(139.3,20.81) v1(141.16,18.75) v1(141.72,20.89) v1(143.69,21.32) v1(146.31,18.46) v1(147.97,18.16) v1(148.03,14.56) v1(148.03,13.27) v1(148.25,7.44) v1(148.28,6.47) v1(148.3,5.51) v1(148.43,21.1) v1(149.17,7.44) v1(149.19,6.47) v1(149.22,5.51) v1(149.56,20.2) v1(149.98,7.44) v1(150,6.47) v1(150.03,5.51) v1(150.47,19.51) v1(150.53,14.54) v1(150.44,13.49) v1(150.59,18.03)
VBAT: length 119.3
  Top Layer w0.2: U2.Y2 97.22,11.69 97.22,12.74 v1(96.85,13.11) ; 96.25,13.7 96.2,13.7
  Top Layer w0.5: 81.48,9.64 81.48,10.15 R8.1 ; 81.48,9.64 C14.1 81.5,8.88 R2.1 ; 81.48,9.64 78.78,9.64 78.45,9.96 U1.2 ; v1(96.85,13.11) 96.25,13.7 ; 96.2,13.7 96.2,14.07
  Top Layer w0.7: 148.88,11.77 148.91,11.73 ; 148.88,11.77 v1(149.15,11.77) 149.01,11.64 TP5.1 148.97,11.06 v1(148.05,11.06) ; 148.88,11.77 148.28,11.77 v1(148.02,12.03) ; U1.2 78.45,16.06 v1(78.45,16.07) ; v1(78.45,18.46) 79.28,19.3 79.48,19.3 80.58,20.4 v1(95.09,20.4) 120.23,20.4 120.87,19.77 148.18,19.77 v1(149.15,18.8)
  Top Layer w0.75: v1(149.93,12.05) 149.42,12.05 v1(149.15,11.77) ; v1(149.96,11.08) 149.03,11.08 TP5.1
  Bottom Layer w0.2: v1(96.85,13.11) 96.83,13.11
  Bottom Layer w0.5: 96.83,13.11 95.81,14.12 95.81,19.67 v1(95.09,20.4)
  Bottom Layer w0.7: v1(149.15,18.8) v1(149.15,11.77) ; v1(148.02,12.03) 148.05,12 v1(148.05,11.06) ; v1(78.45,16.07) v1(78.45,18.46)
  Bottom Layer w0.75: v1(148.99,11.06) v1(148.05,11.06) 148.07,11.04 v1(148.07,10.1) v1(149.01,10.1) ; v1(148.99,11.06) 148.99,11.61 v1(149.15,11.77) ; v1(148.99,11.06) 149,11.08 v1(149.96,11.08) ; v1(148.99,11.06) 149.01,11.04 v1(149.01,10.1) ; v1(149.96,11.08) 149.98,11.06 v1(149.98,10.12) 149.96,10.1 v1(149.01,10.1) ; v1(149.96,11.08) 149.93,11.11 v1(149.93,12.05)
VBUS: length 142.3
  Top Layer w0.2: C1.2 v1(95.12,11.97) 95.69,11.97 U2.AD2 ; U3.4 13.13,13.09 v1(12.67,12.62) 12.67,10.21
  Top Layer w0.7: P1.A9 9.24,4.67 9.58,4.33 9.58,3.32 10.01,2.89 21.65,2.89 ; P1.A4 12.03,9.57 12.67,10.21
  Top Layer w0.75: v1(85.81,7.9) 85.8,7.88 D61.2 ; v1(13.71,15.46) 15.31,15.46 16.25,14.51 23.55,14.51 v1(23.82,14.78) 23.82,5.06 21.65,2.89 ; v1(85.2,18.26) 93.39,18.26 v1(93.41,18.25)
  Bottom Layer w0.2: v1(95.12,11.97) 93.98,13.1 93.98,17.67 v1(93.41,18.25)
  Bottom Layer w0.75: v1(85.81,7.9) 85.81,13.31 ; 85.81,13.31 85.81,17.64 v1(85.2,18.26) ; 85.81,13.31 85.31,13.81 85.31,13.82 84.27,14.87 23.91,14.87 v1(23.82,14.78) ; v1(13.71,15.46) 13.25,15.46 12.62,14.84 12.67,14.8 v1(12.67,12.62)
VDD_NRF: length 62.1
  Top Layer w0.2: U2.AD23 93.84,6.02 93.69,6.18 v1(93.69,6.43) 93.64,6.47 ; 106.78,15.91 v1(106.56,16.13) ; U2.W1 97.64,12.87 98.19,13.42 98.19,14.17 ; 92.81,6.42 C18.2 ; v1(104.67,6.83) 104.67,6.81 104.38,6.52 U2.A22 ; 106.78,14.42 105.39,13.04 104.12,13.04 103.09,12.01 102.14,12.01 U2.B1 ; U2.AD14 v1(94.06,8.52) ; 94.14,14.9 C19.2
  Top Layer w0.5: C16.2 106.59,14.29 106.62,14.26 109.2,14.26 110.23,13.24 v1(110.23,11.57) ; v1(104.67,6.83) 104.81,6.97 C17.2 ; v1(93.08,14.9) 94.14,14.9 ; v1(94.06,8.52) 94,8.57 C20.2 ; 106.78,14.42 106.78,15.91 ; C19.2 94.28,16.21 94.44,16.36 96.61,16.36 v1(96.77,16.2) 97.17,15.79 L3.1 97.62,15.37 98.19,14.81 98.19,14.17 ; C18.2 93.64,6.47
  Bottom Layer w0.2: 106.48,16.2 v1(106.56,16.13) ; 104.75,16.13 104.67,16.2
  Bottom Layer w0.5: v1(110.23,11.57) 110.23,9.14 107.92,6.83 v1(104.67,6.83) ; v1(93.08,14.9) 93.42,14.56 93.42,9.16 v1(94.06,8.52) 93.69,8.15 v1(93.69,6.43) ; v1(96.77,16.2) 106.48,16.2
VSS_PA: length 2.3
  Top Layer w0.127: 100.82,3.77 100.82,5.96 U2.F23
(no net):
  vias: v1(74.97,19.37) v1(77.09,19.37)
/ANT: length 1.5
  Top Layer w0.62: R1.2 94.98,1.8
/CC1: length 2.2
  Top Layer w0.2: P1.A5 10.04,8.37 R6.1
/CC2: length 3.8
  Top Layer w0.2: P1.B5 10.07,5.37 11.28,4.16 11.32,4.16
/COL_0: length 172.1
  Top Layer w0.127: 30.92,16.99 30.88,17.02 ; K41.1 19.32,33.23 K53.1
  Top Layer w0.2: 30.88,17.02 24.2,23.7 K53.1 ; 30.92,16.99 30.97,16.93 98.25,16.93 98.7,16.49 98.7,13.34 98.14,12.78 U2.U1 ; K41.1 28.85,57.04 K28.1 24.08,78.47 K14.1 21.7,95.14 K0.1
/COL_1: length 181.7
  Top Layer w0.2: K1.1 45.52,90.38 K15.1 50.28,76.09 K29.1 59.8,52.28 K42.1 43.13,26.08 43.13,18.96 44.81,17.29 111.06,17.29 111.56,16.78 111.56,11.74 109.84,10.02 U2.A8
/COL_2: length 155.6
  Top Layer w0.2: U2.A10 109.77,9.52 111.87,11.62 111.87,16.91 111.18,17.59 70.48,17.59 66.95,21.13 K55.1 78.85,35.61 K43.1 78.85,47.32 69.33,56.85 K30.1 69.33,65.22 64.56,69.98 K16.1 64.56,85.46 55.04,94.99 K2.1
/COL_3: length 120.1
  Top Layer w0.2: U2.A12 110.17,9.02 112.17,11.02 112.17,17.03 111.31,17.89 102.56,17.89 v1(102.13,18.33) ; K3.1 83.62,90.38 K17.1 88.38,76.09 K31.1 97.9,52.28 K44.1 v1(97.9,22.57) 97.9,22.55
  Bottom Layer w0.2: v1(97.9,22.57) 97.9,22.55 v1(102.13,18.33)
/COL_4: length 111.5
  Top Layer w0.2: v1(112.48,19.48) 112.48,10.91 110.09,8.52 U2.A14 ; K4.1 102.67,90.38 K18.1 107.43,76.09 K32.1 116.95,52.28 K45.1 116.95,41.84 115.48,40.37 115.48,40.36 112.48,37.36 v1(112.48,23.63)
  Bottom Layer w0.2: v1(112.48,23.63) v1(112.48,19.48)
/COL_5: length 135
  Top Layer w0.2: v1(135.15,18.23) 134.78,17.86 113.64,17.86 112.79,17.01 112.79,9.46 111.55,8.22 103.37,8.22 103.14,8 103.12,8.02 U2.A16 ; v1(138.38,21.88) 138.38,40.37 K46.1 136,52.28 K33.1 126.48,76.09 K19.1 121.72,90.38 112.19,99.9
  Bottom Layer w0.2: v1(135.15,18.23) 138.38,21.47 v1(138.38,21.88)
/COL_6: length 146.1
  Top Layer w0.127: K20.1 145.53,76.09 K34.1 155.05,52.28 K47.1
  Top Layer w0.2: K47.1 155.05,30.2 155.1,30.15 v1(155.09,30.13) ; K20.1 140.77,90.38 K6.1 ; U2.A20 103.17,7.02 103.91,7.76 111.89,7.76 113.42,9.3 113.42,16.79 114.12,17.49 142.44,17.49 v1(142.87,17.92)
  Bottom Layer w0.2: v1(155.09,30.13) v1(142.87,17.92)
/COL_7: length 179.6
  Top Layer w0.2: U2.J24 100.14,4.89 99.37,4.13 v1(99.25,4.13) ; K7.1 159.81,90.38 K21.1 164.58,76.09 K35.1 174.1,52.28 K48.1 174.1,26.88 164.41,17.19 114.26,17.19 113.75,16.68 v1(113.75,8.3)
  Bottom Layer w0.2: 113.75,10.82 112.3,12.28 106,12.28 100.11,6.38 100.11,4.78 99.45,4.13 v1(99.25,4.13) ; 113.75,10.82 113.75,8.3
/COL_8: length 194.3
  Top Layer w0.2: U2.L24 99.27,5.15 99.27,4.91 v1(99.36,4.82) ; K8.1 178.87,90.38 K22.1 183.63,76.09 K36.1 193.15,52.28 K49.1 193.15,29.55 180.49,16.89 114.39,16.89 114.06,16.56 114.06,9.48 v1(114.25,9.28)
  Bottom Layer w0.2: v1(114.25,9.28) 114.06,9.48 114.06,11.14 112.61,12.58 105.55,12.58 99.38,6.41 99.38,4.84 v1(99.36,4.82)
/COL_9: length 214.9
  Top Layer w0.2: U2.R24 98.64,5.45 98.34,5.15 v1(98.34,4.67) ; K9.1 197.91,90.38 K23.1 197.91,71.28 202.68,66.52 K37.1 212.2,52.28 K50.1 212.2,26.08 K57.1 209.82,21.97 204.43,16.57 160.65,16.57 160.63,16.59 115.24,16.59 114.36,15.7 114.36,10.64 v1(114.56,10.44)
  Bottom Layer w0.2: v1(98.34,4.67) 98.34,5.13 98.64,5.43 98.64,6.29 105.23,12.88 112.74,12.88 114.36,11.27 114.36,10.64 v1(114.56,10.44)
/COL_10: length 238.6
  Top Layer w0.2: v1(97.64,4.72) 97.64,4.89 98.14,5.38 U2.U24 ; v1(114.86,11.58) 114.66,11.78 114.66,15.24 115.68,16.27 229.69,16.27 233.63,20.21 K58.1 233.63,40.37 K51.1 231.25,52.28 K38.1 221.73,76.09 K24.1 216.97,90.38 K10.1
  Bottom Layer w0.2: v1(97.64,4.72) 97.64,4.89 98.12,5.37 98.12,6.21 105.11,13.19 113.7,13.19 114.66,12.24 114.66,11.78 v1(114.86,11.58)
/COL_11: length 237.2
  Top Layer w0.2: K11.1 236.02,90.38 K25.1 240.78,76.09 K39.1 240.78,25.65 231.09,15.97 115.81,15.97 114.96,15.12 114.96,12.85 v1(115.16,12.65) ; v1(96.89,4.59) 96.89,4.78 U2.W24
  Bottom Layer w0.2: v1(115.16,12.65) 114.95,12.85 114.95,13.31 114.97,13.32 114.8,13.49 104.98,13.49 97.64,6.15 97.64,5.53 96.89,4.78 v1(96.89,4.59)
/COL_12: length 258.6
  Top Layer w0.2: v1(115.75,14.96) 115.75,15.48 115.93,15.67 249.41,15.67 K59.1 257.45,33.23 K52.1 266.97,55.54 271.73,60.3 K40.1 271.73,67.99 258.88,80.85 K26.1 255.06,90.38 K12.1 ; v1(99.67,12.75) 99.64,12.71 U2.L1
  Bottom Layer w0.2: v1(99.67,12.75) 102.5,12.75 104.45,14.7 115.49,14.7 v1(115.75,14.96)
/COL_13: length 269.9
  Top Layer w0.2: U2.N1 99.14,12.63 v1(98.95,12.82) ; K13.1 278.88,95.14 K27.1 284.27,75.45 284.27,26.72 K60.1 272.93,15.37 116.98,15.37 v1(116.59,14.98)
  Bottom Layer w0.2: v1(98.95,12.82) 98.95,12.92 99.41,13.38 102.7,13.38 104.32,15 104.33,15 104.86,15.53 116.05,15.53 v1(116.59,14.98)
/ROW_0: length 394.9
  Top Layer w0.2: D13.1 265.35,110.39 v1(265.35,111.56) ; v1(122.48,111.52) 122.48,111.51 D6.1 ; D9.1 179.62,111.51 v1(179.6,111.52) ; D3.1 65.34,111.5 v1(65.31,111.52) ; D12.1 v1(236.8,111.52) ; D10.1 198.72,111.51 v1(198.72,111.52) ; D8.1 160.57,111.51 v1(160.56,111.52) ; D0.1 8.15,111.51 v1(8.13,111.52) ; v1(141.53,111.52) 141.56,111.49 D7.1 ; v1(84.41,111.52) 84.39,111.5 D4.1 ; v1(27.27,111.52) 27.25,111.5 D1.1 ; v1(103.44,111.52) 103.45,111.51 D5.1 ; D11.1 217.77,111.49 v1(217.74,111.52) ; D2.1 v1(46.29,111.52) ; U2.AD8 95.98,9.87 92.42,9.87 92.13,10.16 91.66,10.16 91.33,9.83 91.03,9.83 v1(90.95,9.75)
  Bottom Layer w0.2: 57.45,111.52 v1(65.31,111.52) v1(84.41,111.52) v1(103.44,111.52) v1(122.48,111.52) v1(141.53,111.52) v1(160.56,111.52) v1(179.6,111.52) v1(198.72,111.52) v1(217.74,111.52) v1(236.8,111.52) 265.31,111.52 v1(265.35,111.56) ; 57.45,111.52 v1(46.29,111.52) v1(27.27,111.52) v1(8.13,111.52) ; 57.45,111.52 57.45,97.08 66.31,88.22 66.31,75.26 72.81,68.75 72.81,57.64 82.92,47.54 82.92,32.18 90.95,24.15 v1(90.95,9.75)
/ROW_1: length 375.6
  Top Layer w0.2: D14.1 v1(12.91,92.47) ; D20.1 132,92.46 v1(132,92.47) ; D26.1 246.31,92.45 v1(246.34,92.47) ; D24.1 208.22,92.44 v1(208.25,92.47) ; D16.1 55.8,92.46 v1(55.82,92.47) ; D22.1 170.12,92.44 v1(170.15,92.47) ; D25.1 227.25,92.46 v1(227.27,92.47) ; D19.1 v1(112.95,92.47) ; D21.1 v1(151.07,92.47) ; D15.1 v1(36.73,92.47) ; D18.1 v1(93.92,92.47) ; v1(189.16,92.47) 189.16,92.46 D23.1 ; v1(59.2,92.47) v1(74.84,92.47) D17.1 ; v1(270.12,92.48) D27.1 ; v1(90.11,9.17) 90.12,9.16 94.75,9.16 94.89,9.02 U2.AD12
  Bottom Layer w0.2: v1(270.12,92.48) 270.11,92.47 v1(246.34,92.47) v1(227.27,92.47) v1(208.25,92.47) v1(189.16,92.47) v1(170.15,92.47) v1(151.07,92.47) v1(132,92.47) v1(112.95,92.47) v1(93.92,92.47) v1(74.84,92.47) ; v1(12.91,92.47) v1(36.73,92.47) v1(55.82,92.47) v1(59.2,92.47) 64.7,86.97 64.7,75.49 71.66,68.53 71.66,57.62 82.09,47.18 82.09,31.99 90.09,24 90.09,9.19 v1(90.11,9.17)
/ROW_2: length 346.2
  Top Layer w0.2: v1(232.06,73.47) 232.03,73.44 D39.1 ; U2.AD16 94.95,8.02 94.73,7.8 89.64,7.8 89.28,8.16 89.28,9.45 v1(89.28,9.46) ; D38.1 212.97,73.46 v1(212.97,73.47) ; v1(41.52,73.47) 41.53,73.46 D29.1 ; D31.1 v1(79.62,73.47) v1(65.37,73.47) ; D30.1 60.59,73.45 v1(60.61,73.47) ; v1(136.75,73.47) 136.78,73.44 D34.1 ; D28.1 v1(15.35,73.47) ; D36.1 v1(174.88,73.47) ; D32.1 98.69,73.46 v1(98.67,73.47) ; D37.1 193.94,73.46 v1(193.94,73.47) ; D33.1 117.73,73.46 v1(117.73,73.47) ; D35.1 v1(155.84,73.47) ; v1(262.99,73.46) D40.1
  Bottom Layer w0.2: v1(15.35,73.47) v1(41.52,73.47) v1(60.61,73.47) v1(65.37,73.47) 70.89,67.94 70.89,57.46 81.34,47.02 81.34,31.94 89.36,23.92 89.55,23.92 89.78,23.68 89.78,14.65 89.34,14.2 89.34,9.51 v1(89.28,9.46) ; v1(262.99,73.46) 262.98,73.47 v1(232.06,73.47) v1(212.97,73.47) v1(193.94,73.47) v1(174.88,73.47) v1(155.84,73.47) v1(136.75,73.47) v1(117.73,73.47) v1(98.67,73.47) v1(79.62,73.47)
/ROW_3: length 315.7
  Top Layer w0.2: v1(222.53,54.53) 222.52,54.52 D51.1 ; D46.1 127.25,54.52 v1(127.24,54.53) ; D42.1 51.07,54.52 v1(51.08,54.53) ; v1(258.26,54.55) 258.26,53.22 D52.1 ; v1(88.81,10.23) 88.73,10.15 88.73,7.84 89.13,7.43 95.18,7.43 95.27,7.52 U2.AD18 ; D41.1 v1(20.08,54.53) ; D47.1 146.31,54.52 v1(146.31,54.53) ; v1(108.23,54.53) 108.2,54.5 D45.1 ; v1(72.81,54.53) v1(89.14,54.53) 89.17,54.51 D44.1 ; v1(70.09,54.53) 70.12,54.51 D43.1 ; D49.1 184.41,54.49 v1(184.38,54.53) ; D50.1 v1(203.46,54.53) ; v1(165.34,54.53) 165.37,54.51 D48.1
  Bottom Layer w0.2: v1(88.81,10.23) 88.81,14.58 89.39,15.17 89.39,21.61 89.42,21.64 89.42,23.43 80.78,32.08 80.78,46.57 v1(72.81,54.53) v1(70.09,54.53) v1(51.08,54.53) v1(20.08,54.53) ; v1(258.26,54.55) 258.25,54.53 v1(222.53,54.53) v1(203.46,54.53) v1(184.38,54.53) v1(165.34,54.53) v1(146.31,54.53) v1(127.24,54.53) v1(108.23,54.53) v1(89.14,54.53)
/ROW_4: length 313.4
  Top Layer w0.2: v1(34.39,35.38) 34.4,35.37 D54.1 ; D53.1 v1(10.58,35.38) ; D56.1 129.6,35.37 v1(129.59,35.38) ; v1(58.2,35.38) 58.19,35.37 D55.1 ; D59.1 248.69,35.37 v1(248.71,35.38) ; v1(79.48,35.38) v1(97.2,35.38) ; D57.1 v1(201.09,35.38) ; v1(272.49,35.39) 272.49,34.18 D60.1 ; D58.1 224.88,35.35 v1(224.91,35.38) ; v1(88.27,10.88) 88.27,7.5 88.64,7.13 95.19,7.13 95.3,7.02 U2.AD20
  Bottom Layer w0.2: v1(10.58,35.38) v1(34.39,35.38) v1(58.2,35.38) 76.36,35.38 ; v1(272.49,35.39) 272.48,35.38 v1(248.71,35.38) v1(224.91,35.38) v1(201.09,35.38) v1(129.59,35.38) v1(97.2,35.38) ; 76.36,35.38 89.05,22.69 89.05,15.51 88.27,14.73 v1(88.27,10.88) ; 76.36,35.38 v1(79.48,35.38)
BAT_VOLT: length 58.8
  Top Layer w0.2: U2.J1 100.14,12.31 100.34,12.52 100.34,12.53 100.48,12.67 100.48,12.94 100.12,13.31 99.53,13.31 99.25,13.59 99.25,16.42 99.64,16.81 108.53,16.81 v1(108.75,16.58)
  Top Layer w0.5: R10.1 84.62,9.78 ; 84.62,9.78 84.62,10.34 ; 84.62,9.78 85.52,9.78 85.87,10.13 85.87,13.25 85.81,13.25 83.64,15.42 83.62,15.42 v1(83.25,15.78) ; 84.62,10.34 C23.2 ; 84.62,10.34 84.61,10.33 83.36,10.33 ; 81.98,18.6 82.42,19.03 107.5,19.03 v1(107.64,18.89)
  Bottom Layer w0.5: v1(82.59,19.03) 82.42,19.03 81.84,18.45 81.84,17.2 v1(83.25,15.78) ; v1(108.75,16.58) 107.64,17.7 v1(107.64,18.89)
BLUE_LED: length 138.6
  Top Layer w0.2: v1(91.92,9.66) 92.06,9.52 U2.AD10 ; v1(1.94,14.44) 2.21,14.17 D63.2 ; v1(90.81,36.16) v1(79.59,36.16)
  Bottom Layer w0.2: v1(90.81,36.16) 90.81,36.16 91.92,35.05 v1(91.92,9.66) ; v1(79.59,36.16) 9.88,36.16 1.9,28.18 1.9,14.49 v1(1.94,14.44)
NET-(C11-PAD2): length 3
  Top Layer w0.62: C11.2 98,2.18 L4.1 96.09,3.17 R1.1
NET-(D0-A): length 12.1
  Top Layer w0.2: K0.2 3.47,104.29 D0.2
NET-(D1-A): length 12.1
  Top Layer w0.2: D1.2 22.51,104.2 K1.2
NET-(D2-A): length 12.1
  Top Layer w0.2: K2.2 41.57,104.24 D2.2
NET-(D3-A): length 12
  Top Layer w0.2: D3.2 60.62,104.21 K3.2
NET-(D4-A): length 12.1
  Top Layer w0.2: K4.2 79.67,104.24 D4.2
NET-(D5-A): length 12.1
  Top Layer w0.2: K5.2 98.72,104.22 D5.2
NET-(D6-A): length 12
  Top Layer w0.2: K6.2 117.77,104.22 D6.2
NET-(D7-A): length 12.1
  Top Layer w0.2: D7.2 136.81,104.19 K7.2
NET-(D8-A): length 12.1
  Top Layer w0.2: D8.2 155.87,104.27 K8.2
NET-(D9-A): length 12.1
  Top Layer w0.2: D9.2 174.91,104.28 K9.2
NET-(D10-A): length 12
  Top Layer w0.2: K10.2 193.97,104.18 D10.2
NET-(D11-A): length 12.1
  Top Layer w0.2: K11.2 213.02,104.22 D11.2
NET-(D12-A): length 12.1
  Top Layer w0.2: D12.2 232.06,104.23 K12.2
NET-(D13-A): length 12.1
  Top Layer w0.2: 260.64,98.85 260.64,104.2 D13.2
NET-(D14-A): length 12.1
  Top Layer w0.2: D14.2 8.23,85.25 K14.2
NET-(D15-A): length 12.1
  Top Layer w0.2: D15.2 32.04,85.24 K15.2
NET-(D16-A): length 12.1
  Top Layer w0.2: K16.2 51.09,85.2 D16.2
NET-(D17-A): length 12.1
  Top Layer w0.2: K17.2 70.14,85.21 D17.2
NET-(D18-A): length 12.1
  Top Layer w0.2: K18.2 89.19,85.21 D18.2
NET-(D19-A): length 12.1
  Top Layer w0.2: 108.24,79.8 108.24,85.2 D19.2
NET-(D20-A): length 12.1
  Top Layer w0.2: K20.2 127.29,85.2 D20.2
NET-(D21-A): length 12.1
  Top Layer w0.2: D21.2 146.34,85.18 K21.2
NET-(D22-A): length 12.1
  Top Layer w0.2: K22.2 165.39,85.19 D22.2
NET-(D23-A): length 12.1
  Top Layer w0.127: D23.2 184.44,85.18 K23.2
NET-(D24-A): length 12.1
  Top Layer w0.2: K24.2 203.49,85.2 D24.2
NET-(D25-A): length 12.1
  Top Layer w0.2: K25.2 222.54,85.19 D25.2
NET-(D26-A): length 12.1
  Top Layer w0.2: K26.2 241.59,85.19 D26.2
NET-(D27-A): length 12.1
  Top Layer w0.127: K27.2 265.4,85.21 D27.2
NET-(D28-A): length 12.1
  Top Layer w0.2: D28.2 10.61,66.16 K28.2
NET-(D29-A): length 12
  Top Layer w0.2: D29.2 36.8,66.11 K29.2
NET-(D30-A): length 12.1
  Top Layer w0.2: D30.2 55.85,66.15 K30.2
NET-(D31-A): length 12.1
  Top Layer w0.2: D31.2 74.9,66.13 K31.2
NET-(D32-A): length 12.1
  Top Layer w0.2: K32.2 93.95,66.17 D32.2
NET-(D33-A): length 12.1
  Top Layer w0.2: D33.2 113,66.13 K33.2
NET-(D34-A): length 12
  Top Layer w0.127: K34.2 132.05,66.12 D34.2
NET-(D35-A): length 12.1
  Top Layer w0.2: D35.2 151.1,66.14 K35.2
NET-(D36-A): length 12.1
  Top Layer w0.2: K36.2 170.15,66.16 D36.2
NET-(D37-A): length 12.1
  Top Layer w0.2: D37.2 189.2,66.13 K37.2
NET-(D38-A): length 12
  Top Layer w0.2: K38.2 208.25,66.11 D38.2
NET-(D39-A): length 12.1
  Top Layer w0.2: D39.2 227.3,66.14 K39.2
NET-(D40-A): length 12.1
  Top Layer w0.2: D40.2 258.26,66.13 K40.2
NET-(D41-A): length 12
  Top Layer w0.2: D41.2 15.37,47.08 K41.2
NET-(D42-A): length 12.1
  Top Layer w0.2: K42.2 46.33,47.06 D42.2
NET-(D43-A): length 12.1
  Top Layer w0.2: K43.2 65.38,47.08 D43.2
NET-(D44-A): length 12.1
  Top Layer w0.2: D44.2 84.43,47.07 K44.2
NET-(D45-A): length 12
  Top Layer w0.2: D45.2 103.48,47.06 K45.2
NET-(D46-A): length 12.1
  Top Layer w0.2: K46.2 122.53,47.09 D46.2
NET-(D47-A): length 12.1
  Top Layer w0.127: K47.2 141.58,47.07 D47.2
NET-(D48-A): length 12.1
  Top Layer w0.2: K48.2 160.63,47.08 D48.2
NET-(D49-A): length 12.1
  Top Layer w0.2: D49.2 179.68,47.05 K49.2
NET-(D50-A): length 12.1
  Top Layer w0.2: K50.2 198.73,47.09 D50.2
NET-(D51-A): length 12.1
  Top Layer w0.2: D51.2 217.78,47.06 K51.2
NET-(D52-A): length 12.1
  Top Layer w0.2: K52.2 253.5,47.05 D52.2
NET-(D53-A): length 12.1
  Top Layer w0.2: D53.2 5.85,28.03 K53.2
NET-(D54-A): length 12
  Top Layer w0.2: D54.2 29.66,27.99 K54.2
NET-(D55-A): length 12.1
  Top Layer w0.2: D55.2 53.47,28.04 K55.2
NET-(D56-A): length 12
  Top Layer w0.2: K56.2 124.91,28.05 D56.2
NET-(D57-A): length 12
  Top Layer w0.127: K57.2 196.35,27.99 D57.2
NET-(D58-A): length 12
  Top Layer w0.2: K58.2 220.16,28.01 D58.2
NET-(D59-A): length 12
  Top Layer w0.2: D59.2 243.97,28.02 K59.2
NET-(D60-A): length 12.1
  Top Layer w0.2: K60.2 267.78,28.04 D60.2
NET-(D61-K): length 5.5
  Top Layer w0.5: 79.41,8.39 79.41,7.74 80.25,6.89 C15.1 82.05,6.89 82.58,6.36 D61.1
NET-(D62-A): length 92.9
  Top Layer w0.2: v1(22.43,17.33) 22.18,17.58 14.79,17.58 13.44,18.94 4.84,18.94 3.2,17.3 D62.2 ; v1(83.75,7.85) 83.75,7.86 R2.2
  Bottom Layer w0.2: v1(83.75,7.85) 84.06,8.15 84.06,11.74 82.62,13.17 22.82,13.17 22.43,13.55 v1(22.43,17.33)
NET-(D62-K): length 79
  Top Layer w0.2: U1.3 77.5,14.58 75.45,16.63 14.07,16.63 12.44,18.26 6.78,18.26 4.77,16.26 D62.1
NET-(D63-K): length 5.7
  Top Layer w0.2: D63.1 4.96,13.96 5.7,13.96 6.81,15.08 6.81,16.33 7.54,17.06 8.38,17.06
NET-(L1-PAD2): length 1.5
  Top Layer w0.5: L1.2 108.17,11.15 L2.1 108.33,12.47
NET-(P1-SHIELD): length 21.7
  Top Layer w0.2: P1.S1 8.22,12.57 R11.2 8.24,14.2 8.24,15.47 C24.1
  Bottom Layer w0.2: P1.S1 P1.S1 P1.S1 P1.S1
NET-(R8-PAD2): length 1.7
  Top Layer w0.5: R8.2 83.34,11.99 R9.1
NET-(U1-ISET): length 2.1
  Top Layer w0.5: 77.5,8.39 77.37,8.25 R3.2
NET-(U1-TS): length 2.5
  Top Layer w0.5: R4.2 79.41,13.04 U1.1
NET-(U2-ANT): length 4
  Top Layer w0.127: C12.2 100.51,3.93 100.51,5.9 U2.H23
  Top Layer w0.62: C12.2 99.75,3.17 L4.2
NET-(U2-DCC): length 5
  Top Layer w0.2: U2.B3 103.05,11.27 104.23,12.45 104.25,12.45 104.28,12.47 L2.2
NET-(U2-DCCH): length 4.7
  Top Layer w0.2: U2.AB2 96.89,11.96 95.27,13.58 95.25,13.58 95.25,14.61 95.25,14.62 95.25,15.02 L3.2
NET-(U2-DEC1): length 4
  Top Layer w0.2: C7.1 104.69,14.2 103,12.52 102.14,12.52 U2.C1
NET-(U2-DEC3): length 4.3
  Top Layer w0.2: C6.1 103.48,3.67 101.39,5.77 U2.D23
NET-(U2-DEC4): length 23.1
  Top Layer w0.2: v1(101.87,2.55) C2.2 102.48,4.17 U2.E24 ; 107.5,11.17 v1(106.22,11.17) 105.66,11.17 105.17,11.65 C3.2 103.97,11.65 103.09,10.77 U2.B5
  Bottom Layer w0.2: v1(106.22,11.17) 106.22,10.79 103.84,8.42 103.84,1.87 103.53,1.55 102.42,1.55 101.87,2.11 v1(101.87,2.55)
NET-(U2-DEC5): length 6.4
  Top Layer w0.2: C5.1 94.47,4.07 98.48,4.07 98.84,4.42 98.84,5.22 U2.N24
NET-(U2-DECUSB): length 3.6
  Top Layer w0.2: U2.AC5 96.52,10.89 96.52,11.65 95.2,12.97 C4.1
NET-(U2-XC1): length 5.7
  Top Layer w0.2: U2.B24 103.14,5.52 103.69,4.97 103.69,4.17 104.34,3.52 Y2.1 104.98,2.59 C21.1
NET-(U2-XC2): length 4.7
  Top Layer w0.2: Y2.3 105.61,5.4 C22.1 102.69,5.97 U2.A23
NET-(U2-XL1{SLASH}P0.00): length 4.4
  Top Layer w0.2: Y1.1 102.31,14.32 C8.2 102.78,13.76 101.28,12.26 101.28,11.71 101.39,11.61 U2.D2
NET-(U2-XL2{SLASH}P0.01): length 4.7
  Top Layer w0.2: U2.F2 100.98,11.62 100.98,13.18 100.19,13.98 Y1.2 100.31,14.44 C9.2
RESET: length 99.3
  Top Layer w0.2: SW1.1 SW1.1 20.1,11.08 21.11,11.08 ; v1(71.62,18.2) 75.28,21.85 v1(92.67,21.85) ; v1(26.47,11.08) 26.47,11.11 27.62,12.26 27.62,14.61 v1(28.96,15.95) ; U2.AC13 U2.AC11 U2.AC9 96.64,10.26 v3(96.61,10.29)
  Bottom Layer w0.2: v3(96.61,10.29) 96.61,11.77 94.77,13.61 94.77,19.01 93.14,20.64 93.14,21.39 v1(92.67,21.85) 92.69,21.86 ; v1(26.47,11.08) 21.11,11.08 ; v1(28.96,15.95) 31.21,18.2 v1(71.62,18.2) 71.64,18.21
  vias: v1(21.11,11.06)
SWC: length 43.6
  Top Layer w0.2: v1(95.83,5) 96.62,5 U2.AA24
  Bottom Layer w0.2: v1(95.83,5) 96.6,5 97.23,5.63 97.23,6.16 104.86,13.79 110.62,13.79 110.62,13.8 125,13.8 129.91,8.88 J3.2
SWD: length 46.8
  Top Layer w0.2: U2.AC24 95.31,5.52 v1(95.2,5.41)
  Bottom Layer w0.2: J3.3 132.46,8.95 127.3,14.1 105.42,14.1 105.41,14.09 104.73,14.09 96.86,6.21 96.86,5.75 96.64,5.54 96.28,5.54 96.27,5.55 95.47,5.55 95.33,5.41 v1(95.2,5.41)
SWO: length 49.3
  Top Layer w0.2: U2.AD22 94.84,6.52 v1(94.8,6.57)
  Bottom Layer w0.2: J3.4 135,9.34 129.93,14.4 104.87,14.4 104.86,14.39 104.61,14.39 96.79,6.57 v1(94.8,6.57)
USB_D+: length 115.3
  Top Layer w0.2: P1.B6 6.4,6.37 6.04,6.73 6.04,7.05 6.57,7.57 7.06,7.57 7.26,7.37 P1.A6 9.1,7.37 9.12,7.35 10.18,7.35 12.06,5.47 12.64,5.47 13.53,6.35 13.53,11.67 v1(13.33,11.87) 13.53,12.07 13.53,12.93 13.51,12.95 13.51,13.44 U3.5 ; v1(87.23,15.88) 87.43,15.68 87.43,13.93 90.81,10.55 96.11,10.55 U2.AD6
  Bottom Layer w0.2: v1(13.33,11.87) 13.53,11.67 13.53,11.17 13.47,11.11 13.47,10.03 13.92,9.58 15.1,9.58 16.52,11 16.52,13.52 23,20 84.75,20 87.43,17.32 87.43,16.08 v1(87.23,15.88)
USB_D-: length 114.8
  Top Layer w0.2: U2.AD4 96.11,11 91,11 87.88,14.11 87.88,15.68 v1(88.08,15.88) ; v1(6.81,6.97) 6.92,6.87 P1.A7 9.1,6.87 9.12,6.9 10,6.9 11.88,5.02 12.83,5.02 13.98,6.17 13.98,11.67 v1(14.18,11.87) 13.98,12.07 13.98,13.1 13.96,13.12 13.96,13.44 U3.6 ; P1.B7 7.23,7.87 6.77,8.33 v1(6.68,8.33)
  Bottom Layer w0.2: v1(14.18,11.87) 13.98,11.67 13.98,11 13.92,10.94 13.92,10.21 14.11,10.03 14.91,10.03 16.07,11.18 16.07,13.7 22.81,20.45 84.94,20.45 87.88,17.5 87.88,16.08 v1(88.08,15.88) ; v1(6.81,6.97) 6.81,8.19 v1(6.68,8.33)

## Copper pours and planes (outline as drawn; the poured copper is in the pictures)
GND on Top Layer: -0.17,114.46 -0.13,0.93 285.64,0.93 285.64,114.46
GND on Bottom Layer: -0.92,114.15 285.04,114.15 285.04,0.83 -0.92,0.83
GND on Bottom Layer: 107.05,10.78 107.06,10.27 107.02,9.13 109.36,9.33 109.91,10.99 109.68,11.39 108.7,11.5
GND on Bottom Layer: -0.08,114.34 -0.04,0.81 285.74,0.81 285.74,114.34

## Text on the board
Bottom Silkscreen Layer: BLUEPRINT | xd keyboard
Top Silkscreen Layer: HACKCLUB | ZMK
